# Altium schematic sheet MCU_STM32L010K4T6.SchDoc
size A4; SheetNumber: 4; SheetTotal: 6
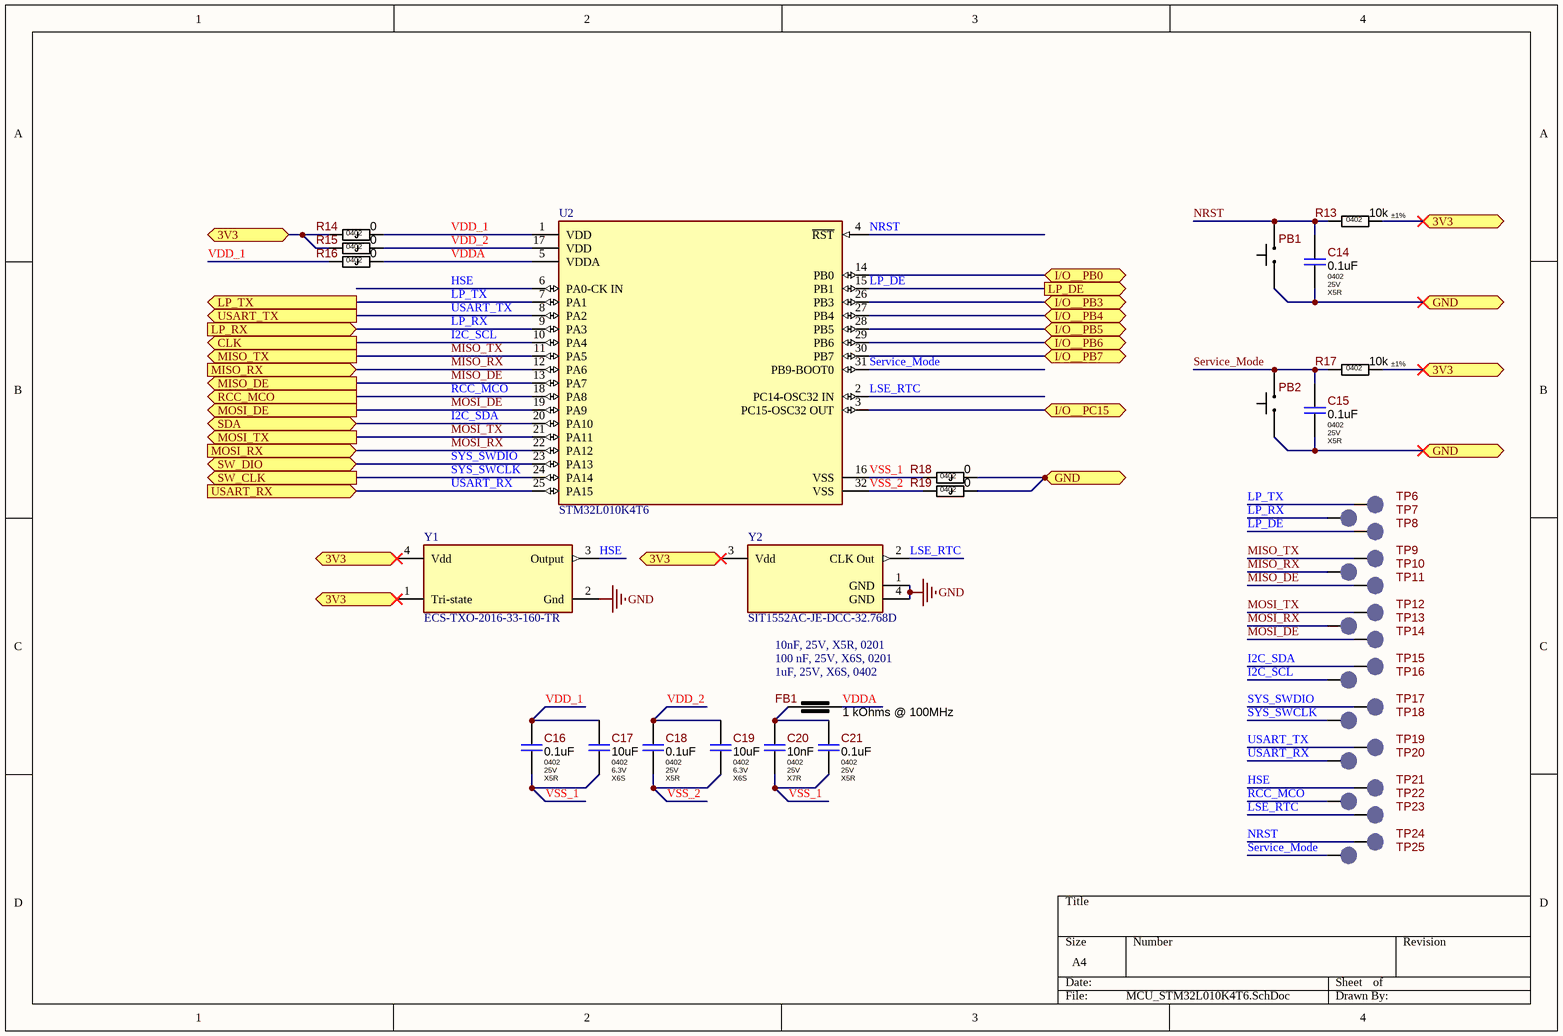
[diagram p0: MCU_STM32L010K4T6.SchDoc]

## Parts
C14  Package: 0402  Voltage: 25V  Dielectric Type: X5R  [C_CERAMIC_0402_HI]  (hidden comment: 0.1uF)
C15  Package: 0402  Voltage: 25V  Dielectric Type: X5R  [C_CERAMIC_0402_HI]  (hidden comment: 0.1uF)
C16  Package: 0402  Voltage: 25V  Dielectric Type: X5R  [C_CERAMIC_0402_HI]  (hidden comment: 0.1uF)
C17  Package: 0402  Voltage: 6.3V  Dielectric Type: X6S  [C_CERAMIC_0402_HI]  (hidden comment: 10uF)
C18  Package: 0402  Voltage: 25V  Dielectric Type: X5R  [C_CERAMIC_0402_HI]  (hidden comment: 0.1uF)
C19  Package: 0402  Voltage: 6.3V  Dielectric Type: X6S  [C_CERAMIC_0402_HI]  (hidden comment: 10uF)
C20  Package: 0402  Voltage: 25V  Dielectric Type: X7R  [C_CERAMIC_0402_HI]  (hidden comment: 10nF)
C21  Package: 0402  Voltage: 25V  Dielectric Type: X5R  [C_CERAMIC_0402_HI]  (hidden comment: 0.1uF)
FB1  value 1 kOhms @ 100MHz  [BLM15xxxxxSN1x_MED]  (hidden comment: BLM15AX102SN1D)
PB1  DS1042-24-2017VBR16005  [DS1042-24-2017VB]  (value not drawn)
PB2  DS1042-24-2017VBR16005  [DS1042-24-2017VB]  (value not drawn)
R13  Tolerance: ±1%  Package: 0402  [R_ANY_CHIP_0402_MED]  (hidden comment: 10k)
R14  Package: 0402  [R_ANY_CHIP_0402_MED]  (hidden comment: 0)
R15  Package: 0402  [R_ANY_CHIP_0402_MED]  (hidden comment: 0)
R16  Package: 0402  [R_ANY_CHIP_0402_MED]  (hidden comment: 0)
R17  Tolerance: ±1%  Package: 0402  [R_ANY_CHIP_0402_MED]  (hidden comment: 10k)
R18  Package: 0402  [R_ANY_CHIP_0402_MED]  (hidden comment: 0)
R19  Package: 0402  [R_ANY_CHIP_0402_MED]  (hidden comment: 0)
TP6  LED_LINK  [TP_SMD_2mm]  (value not drawn)  (no BOM)
TP7  LED_LINK  [TP_SMD_2mm]  (value not drawn)  (no BOM)
TP8  LED_LINK  [TP_SMD_2mm]  (value not drawn)  (no BOM)
TP9  LED_LINK  [TP_SMD_2mm]  (value not drawn)  (no BOM)
TP10  LED_LINK  [TP_SMD_2mm]  (value not drawn)  (no BOM)
TP11  LED_LINK  [TP_SMD_2mm]  (value not drawn)  (no BOM)
TP12  LED_LINK  [TP_SMD_2mm]  (value not drawn)  (no BOM)
TP13  LED_LINK  [TP_SMD_2mm]  (value not drawn)  (no BOM)
TP14  LED_LINK  [TP_SMD_2mm]  (value not drawn)  (no BOM)
TP15  LED_LINK  [TP_SMD_2mm]  (value not drawn)  (no BOM)
TP16  LED_LINK  [TP_SMD_2mm]  (value not drawn)  (no BOM)
TP17  LED_LINK  [TP_SMD_2mm]  (value not drawn)  (no BOM)
TP18  LED_LINK  [TP_SMD_2mm]  (value not drawn)  (no BOM)
TP19  LED_LINK  [TP_SMD_2mm]  (value not drawn)  (no BOM)
TP20  LED_LINK  [TP_SMD_2mm]  (value not drawn)  (no BOM)
TP21  LED_LINK  [TP_SMD_2mm]  (value not drawn)  (no BOM)
TP22  LED_LINK  [TP_SMD_2mm]  (value not drawn)  (no BOM)
TP23  LED_LINK  [TP_SMD_2mm]  (value not drawn)  (no BOM)
TP24  LED_LINK  [TP_SMD_2mm]  (value not drawn)  (no BOM)
TP25  LED_LINK  [TP_SMD_2mm]  (value not drawn)  (no BOM)
U2  STM32L010K4T6  [FP-LQFP32-5V-MFG]
Y1  ECS-TXO-2016-33-160-TR  [FP-TXO-2016-MFG]
Y2  SIT1552AC-JE-DCC-32.768D  [FP-SiT1552-J-MFG]

## Ports
3V3 (bidir, see UI[3C], DC-DC_5V0_To_3V3[3B]), CLK (out), GND (bidir, see UI[2C], DC-DC_5V0_To_3V3[2C], DC-DC_24V_To_5V0[1C], Display_4DLCD-35480320-IPS[2A], Display_4DLCD-35480320-IPS[2B], Display_4DLCD-35480320-IPS[2D]), I/O__PB0 (bidir, see UI[3C]), I/O__PB3 (bidir, see UI[3C]), I/O__PB4 (bidir, see UI[2D]), I/O__PB5 (bidir, see UI[3C]), I/O__PB6 (bidir, see UI[3D]), I/O__PB7 (bidir, see UI[3D]), I/O__PC15 (bidir, see UI[3C]), LP_DE (out, see UI[3C]), LP_RX (in, see UI[3C]), LP_TX (out, see UI[3C]), MISO_DE (out, see UI[3C]), MISO_RX (in, see UI[3C]), MISO_TX (out, see UI[3C]), MOSI_DE (out, see UI[3C]), MOSI_RX (in, see UI[3C]), MOSI_TX (out, see UI[3C]), RCC_MCO (out, see UI[2C]), SDA (bidir), SW_CLK (out, see UI[2C]), SW_DIO (bidir, see UI[2C]), USART_RX (in, see UI[2C]), USART_TX (out, see UI[2C])

## Nets
GND: Y1.2(Gnd) Y2.1(GND) Y2.4(GND)
3V3: R13.1 R14.2 R15.2 R17.1 Y1.1(Tri-state) Y1.4(Vdd) Y2.3(Vdd) ; port 3V3
GND: C14.2 C15.2 PB1.1 PB2.1 R18.1 R19.1 ; port GND  [a separate net that carries the same name]
HSE: TP21.1 U2.6(PA0-CK_IN) Y1.3(Output)
I2C_SCL: TP16.1 U2.10(PA4) ; port CLK
I2C_SDA: TP15.1 U2.20(PA10) ; port SDA
I/O__PB0: U2.14(PB0) ; port I/O__PB0
I/O__PB3: U2.26(PB3) ; port I/O__PB3
I/O__PB4: U2.27(PB4) ; port I/O__PB4
I/O__PB5: U2.28(PB5) ; port I/O__PB5
I/O__PB6: U2.29(PB6) ; port I/O__PB6
I/O__PB7: U2.30(PB7) ; port I/O__PB7
I/O__PC15: U2.3(PC15-OSC32_OUT) ; port I/O__PC15
LP_DE: TP8.1 U2.15(PB1) ; port LP_DE
LP_RX: TP7.1 U2.9(PA3) ; port LP_RX
LP_TX: TP6.1 U2.7(PA1) ; port LP_TX
LSE_RTC: TP23.1 U2.2(PC14-OSC32_IN) Y2.2(CLK_Out)
MISO_DE: TP11.1 U2.13(PA7) ; port MISO_DE
MISO_RX: TP10.1 U2.12(PA6) ; port MISO_RX
MISO_TX: TP9.1 U2.11(PA5) ; port MISO_TX
MOSI_DE: TP14.1 U2.19(PA9) ; port MOSI_DE
MOSI_RX: TP13.1 U2.22(PA12) ; port MOSI_RX
MOSI_TX: TP12.1 U2.21(PA11) ; port MOSI_TX
NRST: C14.1 PB1.2 R13.2 TP24.1 U2.4(~{RST})
RCC_MCO: TP22.1 U2.18(PA8) ; port RCC_MCO
Service_Mode: C15.1 PB2.2 R17.2 TP25.1 U2.31(PB9-BOOT0)
SYS_SWCLK: TP18.1 U2.24(PA14) ; port SW_CLK
SYS_SWDIO: TP17.1 U2.23(PA13) ; port SW_DIO
USART_RX: TP20.1 U2.25(PA15) ; port USART_RX
USART_TX: TP19.1 U2.8(PA2) ; port USART_TX
VDD_1: C16.1 C17.1 R14.1 R16.2 U2.1(VDD)
VDD_2: C18.1 C19.1 R15.1 U2.17(VDD)
VDDA: FB1.1 R16.1 U2.5(VDDA)
VSS_1: C16.2 C17.2 C20.2 C21.2 R18.2 U2.16(VSS)
VSS_2: C18.2 C19.2 R19.2 U2.32(VSS)
NetC20_1: C20.1 C21.1 FB1.2

## Notes on the sheet
- 10nF, 25V, X5R, 0201
- (near FB1) 1uF, 25V, X6S, 0402
- 100 nF, 25V, X6S, 0201

## Library data of the parts
C14 C15 = CL05A104KA5NNNC: 100nF 25V X5R ±10% 0402 Ceramic Capacitor RoHS; Manufacturer: Samsung Electro-Mechanics; Standard Lead Time: 38 Weeks; Replacement: NONE; Component Status: Released; Value: 0.1uF; Part Number: CL05A104KA5NNNC; Part Type: Ceramic / X5R / 0402; Component Type: SMD; Temperature Range: -55°C ~ 85°C; Tolerance: ±10%; ComponentLink1URL: https://eu.mouser.com/datasheet/2/585/MLCC-1837944.pdf; Supplier 1: Mouser; Supplier Part Number 1: 187-CL05A104KA5NNNC; ComponentLink1Description: Datasheet; Price: 0.0013
C16 C18 C21 = CL05A104KA5NNNC: 100nF 25V X5R ±10% 0402 Ceramic Capacitor RoHS; Manufacturer: Samsung Electro-Mechanics; Standard Lead Time: 38 Weeks; Component Status: Released; Replacement: NONE; Value: 0.1uF; Part Number: CL05A104KA5NNNC; Part Type: Ceramic / X5R / 0402; Component Type: SMD; Temperature Range: -55°C ~ 85°C; Tolerance: ±10%; ComponentLink1URL: https://eu.mouser.com/datasheet/2/585/MLCC-1837944.pdf; ComponentLink1Description: Datasheet; Price: 0.0013; Supplier 1: Mouser; Supplier Part Number 1: 187-CL05A104KA5NNNC
C17 C19 = GRM155C80J106ME11D: 10uF 6.3V X6S ±20% 0402 Ceramic Capacitor RoHS; Manufacturer: Murata Electronics; Component Status: Released; Standard Lead Time: 15 Weeks; Replacement: NONE; Value: 10uF; Part Number: GRM155C80J106ME11D; Part Type: Ceramic / X6S / 0402; Component Type: SMD; Temperature Range: -55°C ~ 105°C; Tolerance: ±20%; ComponentLink1URL: https://search.murata.co.jp/Ceramy/image/img/A01X/G101/ENG/GRM155C80J106ME11-01.pdf; Supplier 1: Digi-Key; Supplier Part Number 1: 490-13233-1-ND; Price: 0.01104; ComponentLink1Description: Datasheet
C20 = CL05B103KA5NNNC: 10nF 25V X7R ±10% 0402 Ceramic Capacitor RoHS; Manufacturer: Samsung Electro-Mechanics; Component Status: Released; Standard Lead Time: 28 Weeks; Replacement: NONE; Value: 10nF; Part Number: CL05B103KA5NNNC; Part Type: Ceramic / X7R / 0402; Component Type: SMD; Temperature Range: -55°C ~ 125°C; Tolerance: ±10%; ComponentLink1URL: https://eu.mouser.com/datasheet/2/585/MLCC-1837944.pdf; Supplier 1: Mouser; Supplier Part Number 1: 187-CL05B103KA5NNNC; Price: 0.00145; ComponentLink1Description: Datasheet
FB1 = BLM15AX102SN1D: 1 kOhms @ 100MHz Ferrite Bead 0402, 350mA 490mOhm; Manufacturer: Murata Electronics; Current: 0.35A; Saturation Current: NONE; Tolerance: ±25%; Standard Lead Time: 7 Weeks; Component Status: Released; Package: 0402; Part Number: BLM15AX102SN1D; Part Type: Ferrite Bead; Component Type: SMD; Temperature Range: -55°C ~ 125°C; ComponentLink1URL: https://www.murata.com/en-us/products/productdata/8796740059166/ENFA0018.pdf; Supplier 1: Digi-Key; Supplier Part Number 1: 490-5442-2-ND; Replacement: NONE; Price: 0.00265; ComponentLink1Description: Datasheet
PB1 PB2 = DS1042-24-2017VBR16005: Tactile Switch 2.5x3mm, SMD, 160gf, Height 1.7mm, 50mA 12VDC; Manufacturer: Connfly; Replacement: NONE; Part Number: DS1042-24-2017VBR16005; Part Type: Switch / Tactile; Component Type: SMD; Temperature Range: -20°C ~ 70°C
R13 R17 = RC0402FR-0710KL: 10 kOhms ±1% 1/16W 0402 Thick Film Resistor; Manufacturer: Yageo; Power Rating: 0.062W; Voltage: 50V; Temperature Stability: ±100ppm/°C; Replacement: NONE; Component Status: Released; Value: 10k; Part Number: RC0402FR-0710KL; Component Type: SMD; Temperature Range: -55°C ~ 155°C; ComponentLink1URL: https://eu.mouser.com/datasheet/2/447/PYu_RC_Group_51_RoHS_L_10-1664068.pdf; Supplier 1: Digi-Key; Supplier Part Number 1: 311-10.0KLRTR-ND; ComponentLink1Description: Datasheet; Part Type: Thick Film; Price: 0,00065
R14-R16 R18 R19 = RC0402JR-070RL: 0 Ohms Jumper ±5% 1/16W 0402 Thick Film Resistor; Manufacturer: Yageo; Power Rating: 0.062W; Voltage: 50V; Component Status: Released; Temperature Stability: NONE; Tolerance: ±5%; Value: 0; Part Number: RC0402JR-070RL; Component Type: SMD; Part Type: Thick Film; Temperature Range: -55°C ~ 155°C; ComponentLink1URL: https://eu.mouser.com/datasheet/2/447/PYu_RC_Group_51_RoHS_L_10-1664068.pdf; Supplier 1: Digi-Key; Supplier Part Number 1: 311-0.0JRTR-ND; Replacement: NONE; Price: 0.00045; ComponentLink1Description: Datasheet
TP6-TP25 = TP-PAD-SMD: Test Point SMD Pad 1.0mm/1.5mm/2mm; Part Number: TP-PAD-SMD; Part Type: Test Point; Component Type: SMD
U2 = CMP-12105-000001-1: 16/32-BITS MICROS; Manufacturer: STMicroelectronics; Number Of Cores: 1; Core Architecture: ARM Cortex-M0+; Number Of Adc Channels: 10; Data Bus Width: 32bits; Frequency: 32MHz; Number Of I/Os: 26; Memory Size: 16KBytes; Max Junction Temp: +105°C; Memory Type: FLASH; Number Of Uart Channels: 2; Ram Size: 2KBytes; Number Of Timers/Counters: 5; Nominal Supply Current: 22-5400uA; Interface: I2C,SPI,UART,USART,SMBus; Min Supply Voltage: 1.8V; Max Supply Voltage: 3.6V; Standoff Height: 0.05mm; ComponentLink2Description: Datasheet; Temperature Range High: +85°C; Device Class L2: Embedded Processors and Controllers; Package: LQFP32-5V; Manufacturer Part Number: STM32L010K4T6; Ambient Temperature Range Low: -40°C; RoHS: TRUE; Digikey Description: 16/32-BITS MICROS; Lead Free: Yes; Category: IC; Height: 1.6mm; ComponentLink2URL: https://www.st.com/resource/en/datasheet/stm32l010f4.pdf; Temperature Range Low: -40°C; Automotive: No; Device Class L3: Microcontrollers; Device Class L1: Integrated Circuits (ICs); Octopart: https://octopart.com/stm32l010k4t6-stmicroelectronics-96493833; Temperature: -40°C to +85°C; Number Of Spi Channels: 1; Number Of I2C Channels: 1; Ambient Temperature Range High: +85°C; Number Of A/D Converters: 1; Part Number: STM32L010K4T6; Supplier 1: Mouser; Supplier Part Number 1: 511-STM32L010K4T6
Y1 = CMP-40224-000008-1: XTAL OSC TCXO 16MHZ 3.3V SMD; Manufacturer: ECS; Max Supply Voltage: 3.63V; Max Supply Current: 7mA; Stability: 2ppm; Min Supply Voltage: 2.97V; Load Capacitance: 15pF; Frequency: 16MHz; Device Class L1: Passive Components; Manufacturer Part Number: ECS-TXO-2016-33-160-TR; Digikey Description: XTAL OSC TCXO 16MHZ 3.3V SMD; Device Class L3: Oscillators; Category: Crys; Lead Free: Yes; Temperature: -40°C to +85°C; RoHS: TRUE; ComponentLink2Description: Datasheet; Octopart: https://octopart.com/ecs-txo-2016-33-160-tr-ecs+international-102811109; ComponentLink2URL: https://ecsxtal.com/store/pdf/ECS-TXO-2016.pdf; Temperature Range High: +85°C; Height: 0.8mm; Device Class L2: Crystals / Oscillators; Package: TXO-2016; Temperature Range Low: -40°C; Series: TXO-2016; Automotive: No; Part Number: ECS-TXO-2016-33-160-TR; Supplier 1: Mouser; Supplier Part Number 1: 520-TXO-2016-33-160T
Y2 = CMP-25159-260295-1: MEMS OSC TCXO 32.7680KHZ LVCMOS; Frequency Stability: 5ppm; Frequency: 32.768kHz; Min Operating Temperature: 0°C; Length: 0.061inch; Mount: Surface Mount; Max Operating Temperature: 70°C; Width: 0.033inch; RoHS Compliant: Yes; Series: SiT1552; Packaging: Cut Tape; Height: 0.024inch; ComponentLink1Description: Datasheet; ComponentLink1URL: https://eu.mouser.com/datasheet/2/371/SiT1552_datasheet-1511133.pdf; Part Number: SIT1552AC-JE-DCC-32.768D; Supplier 1: Mouser; Supplier Part Number 1: 788-1552ACJEDCC32.7D